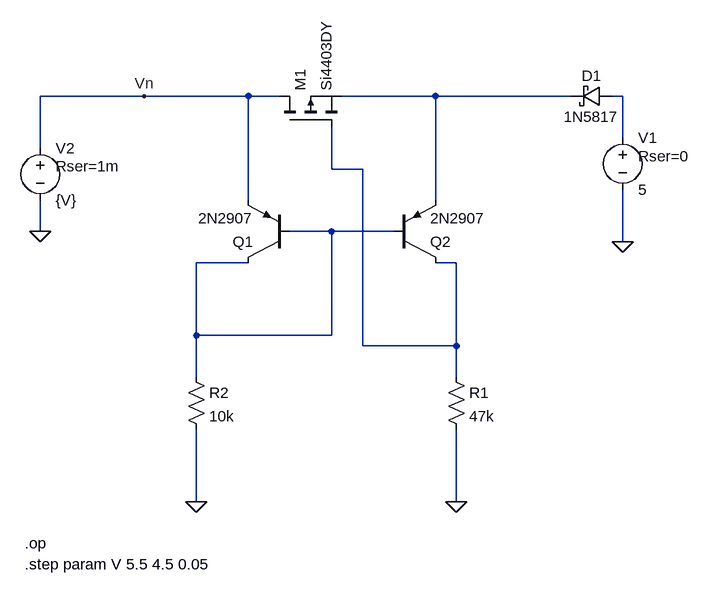
[diagram p0: schematic single_zvd.asc]
single_zvd.asc, the LTspice schematic file:
Version 4
SHEET 1 888 680
WIRE 32 -144 -128 -144
WIRE 192 -144 32 -144
WIRE 240 -144 192 -144
WIRE 480 -144 336 -144
WIRE 688 -144 480 -144
WIRE 768 -144 752 -144
WIRE 768 -80 768 -144
WIRE -128 -64 -128 -144
WIRE 320 -32 320 -96
WIRE 368 -32 320 -32
WIRE 192 16 192 -144
WIRE 480 16 480 -144
WIRE -128 64 -128 16
WIRE 320 64 256 64
WIRE 416 64 320 64
WIRE 768 80 768 0
WIRE 192 112 112 112
WIRE 512 112 480 112
WIRE 112 224 112 112
WIRE 320 224 320 64
WIRE 320 224 112 224
WIRE 368 240 368 -32
WIRE 512 240 512 112
WIRE 512 240 368 240
WIRE 112 288 112 224
WIRE 512 288 512 240
WIRE 112 480 112 368
WIRE 512 480 512 368
FLAG 112 480 0
FLAG 512 480 0
FLAG 768 80 0
FLAG -128 64 0
FLAG 32 -144 Vn
DATAFLAG 560 -144 ""
DATAFLAG 32 -144 ""
DATAFLAG 112 256 ""
DATAFLAG 512 240 ""
DATAFLAG 192 -48 "$-V(N009)"
SYMBOL pmos 240 -96 R270
SYMATTR InstName M1
SYMATTR Value Si4403DY
SYMBOL pnp 256 112 R180
SYMATTR InstName Q1
SYMATTR Value 2N2907
SYMBOL pnp 416 112 M180
SYMATTR InstName Q2
SYMATTR Value 2N2907
SYMBOL res 496 272 R0
SYMATTR InstName R1
SYMATTR Value 47k
SYMBOL res 96 272 R0
SYMATTR InstName R2
SYMATTR Value 10k
SYMBOL voltage 768 -96 R0
WINDOW 123 0 0 Left 0
WINDOW 39 24 44 Left 2
SYMATTR InstName V1
SYMATTR Value 5
SYMATTR SpiceLine Rser=0
SYMBOL voltage -128 -80 R0
WINDOW 123 0 0 Left 0
WINDOW 39 24 44 Left 2
SYMATTR InstName V2
SYMATTR Value {V}
SYMATTR SpiceLine Rser=1m
SYMBOL schottky 752 -160 R90
WINDOW 0 0 32 VBottom 2
WINDOW 3 32 32 VTop 2
SYMATTR InstName D1
SYMATTR Value 1N5817
SYMATTR Description Diode
SYMATTR Type diode
TEXT -152 544 Left 2 !.op
TEXT -152 576 Left 2 !.step param V 5.5 4.5 0.05

The netlist it stands for:
* single_zvd.asc
M1 Vn N003 N001 N001 Si4403DY
Q1 N004 N004 Vn 0 2N2907
Q2 N003 N004 N001 0 2N2907
R1 N003 0 47k
R2 N004 0 10k
V1 N002 0 5 Rser=0
V2 Vn 0 {V} Rser=1m
D1 N002 N001 1N5817
.model D D
.lib standard.dio
.model NPN NPN
.model PNP PNP
.lib standard.bjt
.model NMOS NMOS
.model PMOS PMOS
.lib standard.mos
.op
.step param V 5.5 4.5 0.05
.backanno
.end